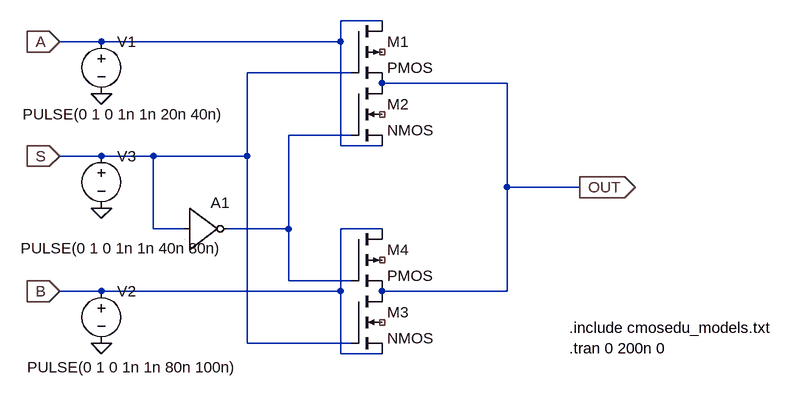
[diagram p0: schematic 2-1 mux.asc]
2-1 mux.asc, the LTspice schematic file:
Version 4
SHEET 1 956 680
WIRE 352 96 288 96
WIRE -80 128 -144 128
WIRE 288 128 288 96
WIRE 288 128 -80 128
WIRE 304 176 144 176
WIRE 544 192 352 192
WIRE 304 272 208 272
WIRE 288 288 288 128
WIRE 352 288 288 288
WIRE -80 304 -144 304
WIRE 0 304 -80 304
WIRE 144 304 144 176
WIRE 144 304 0 304
WIRE 544 352 544 192
WIRE 656 352 544 352
WIRE 0 416 0 304
WIRE 48 416 0 416
WIRE 208 416 208 272
WIRE 208 416 112 416
WIRE 352 416 288 416
WIRE 208 496 208 416
WIRE 304 496 208 496
WIRE -80 512 -144 512
WIRE 288 512 288 416
WIRE 288 512 -80 512
WIRE 544 512 544 352
WIRE 544 512 352 512
WIRE 144 592 144 304
WIRE 304 592 144 592
WIRE 288 608 288 512
WIRE 352 608 288 608
FLAG -144 128 A
IOPIN -144 128 In
FLAG -144 512 B
IOPIN -144 512 In
FLAG -144 304 S
IOPIN -144 304 In
FLAG 656 352 OUT
IOPIN 656 352 Out
FLAG -80 208 0
FLAG -80 384 0
FLAG -80 592 0
SYMBOL pmos4 304 96 R0
SYMATTR InstName M1
SYMBOL nmos4 304 192 R0
SYMATTR InstName M2
SYMBOL nmos4 304 512 R0
SYMATTR InstName M3
SYMBOL pmos4 304 416 R0
SYMATTR InstName M4
SYMBOL Digital/inv 48 352 R0
SYMATTR InstName A1
SYMBOL voltage -80 112 R0
WINDOW 3 -121 128 Left 2
SYMATTR InstName V1
SYMATTR Value PULSE(0 1 0 1n 1n 20n 40n)
SYMBOL voltage -80 496 R0
WINDOW 3 -114 133 Left 2
SYMATTR InstName V2
SYMATTR Value PULSE(0 1 0 1n 1n 80n 100n)
SYMBOL voltage -80 288 R0
WINDOW 3 -124 158 Left 2
SYMATTR InstName V3
SYMATTR Value PULSE(0 1 0 1n 1n 40n 80n)
TEXT 640 568 Left 2 !.include cmosedu_models.txt
TEXT 640 600 Left 2 !.tran 0 200n 0

The netlist it stands for:
* 2-1 mux.asc
M1 A S OUT NC_01 PMOS
M2 OUT N001 A NC_02 NMOS
M3 OUT S B NC_03 NMOS
M4 B N001 OUT NC_04 PMOS
A1 S 0 0 0 0 N001 0 0 BUF
V1 A 0 PULSE(0 1 0 1n 1n 20n 40n)
V2 B 0 PULSE(0 1 0 1n 1n 80n 100n)
V3 S 0 PULSE(0 1 0 1n 1n 40n 80n)
.model NMOS NMOS
.model PMOS PMOS
.lib standard.mos
.include cmosedu_models.txt
.tran 0 200n 0
.backanno
.end